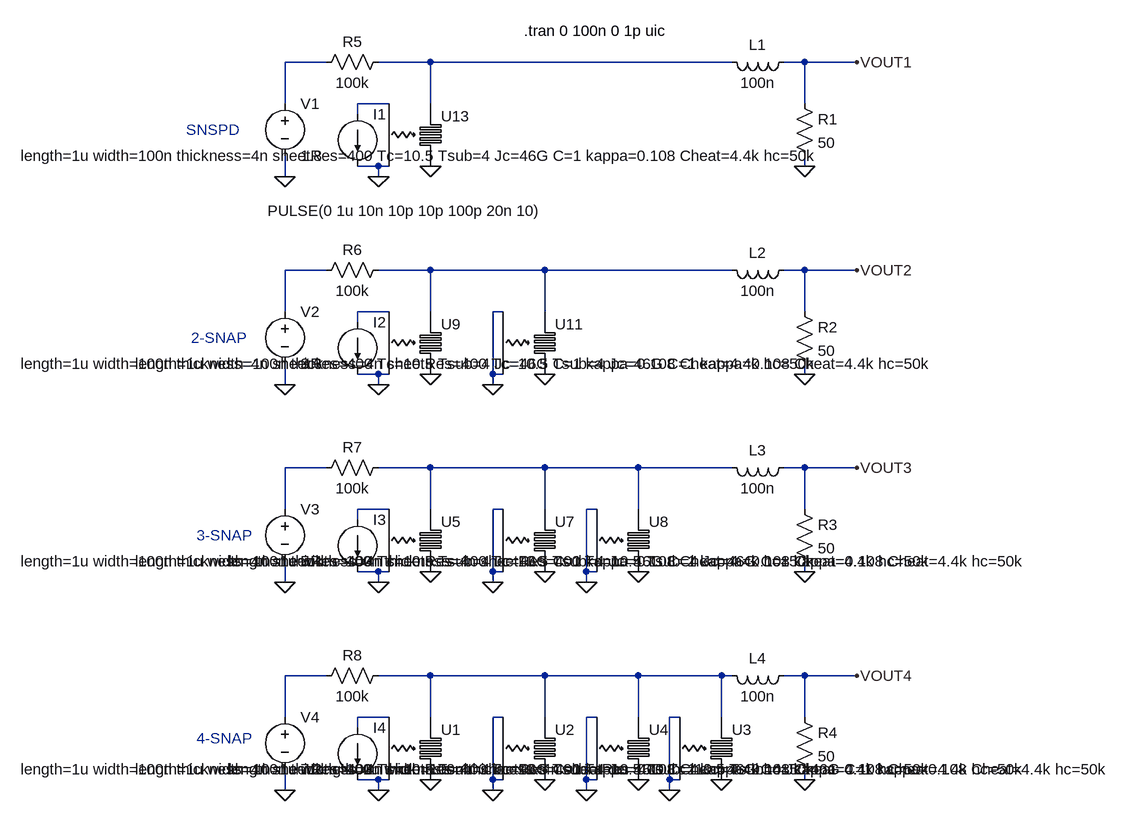
[diagram p0: schematic snspd-multi-snap-50nH-wire-100nH-Choke.asc]
snspd-multi-snap-50nH-wire-100nH-Choke.asc, the LTspice schematic file:
Version 4
SHEET 1 880 680
WIRE -208 -912 -272 -912
WIRE -48 -912 -128 -912
WIRE 416 -912 -48 -912
WIRE 528 -912 496 -912
WIRE 608 -912 528 -912
WIRE -272 -848 -272 -912
WIRE -112 -848 -160 -848
WIRE -48 -848 -48 -912
WIRE 528 -848 528 -912
WIRE -160 -832 -160 -848
WIRE -128 -752 -160 -752
WIRE -112 -752 -128 -752
WIRE 528 -752 528 -768
WIRE -272 -736 -272 -768
WIRE -128 -736 -128 -752
WIRE -208 -592 -272 -592
WIRE -48 -592 -128 -592
WIRE 128 -592 -48 -592
WIRE 416 -592 128 -592
WIRE 528 -592 496 -592
WIRE 608 -592 528 -592
WIRE -272 -528 -272 -592
WIRE -112 -528 -160 -528
WIRE -48 -528 -48 -592
WIRE 64 -528 48 -528
WIRE 128 -528 128 -592
WIRE 528 -528 528 -592
WIRE -160 -512 -160 -528
WIRE -128 -432 -160 -432
WIRE -112 -432 -128 -432
WIRE 48 -432 48 -528
WIRE 64 -432 48 -432
WIRE 528 -432 528 -448
WIRE -272 -416 -272 -448
WIRE -128 -416 -128 -432
WIRE 48 -416 48 -432
WIRE -208 -288 -272 -288
WIRE -48 -288 -128 -288
WIRE 128 -288 -48 -288
WIRE 272 -288 128 -288
WIRE 416 -288 272 -288
WIRE 528 -288 496 -288
WIRE 608 -288 528 -288
WIRE -272 -224 -272 -288
WIRE -112 -224 -160 -224
WIRE -48 -224 -48 -288
WIRE 64 -224 48 -224
WIRE 128 -224 128 -288
WIRE 208 -224 192 -224
WIRE 272 -224 272 -288
WIRE 528 -224 528 -288
WIRE -160 -208 -160 -224
WIRE -128 -128 -160 -128
WIRE -112 -128 -128 -128
WIRE 48 -128 48 -224
WIRE 64 -128 48 -128
WIRE 192 -128 192 -224
WIRE 208 -128 192 -128
WIRE 528 -128 528 -144
WIRE -272 -112 -272 -144
WIRE -128 -112 -128 -128
WIRE 48 -112 48 -128
WIRE 192 -112 192 -128
WIRE -208 32 -272 32
WIRE -48 32 -128 32
WIRE 128 32 -48 32
WIRE 272 32 128 32
WIRE 400 32 272 32
WIRE 416 32 400 32
WIRE 528 32 496 32
WIRE 608 32 528 32
WIRE -272 96 -272 32
WIRE -112 96 -160 96
WIRE -48 96 -48 32
WIRE 64 96 48 96
WIRE 128 96 128 32
WIRE 208 96 192 96
WIRE 272 96 272 32
WIRE 336 96 320 96
WIRE 400 96 400 32
WIRE 528 96 528 32
WIRE -160 112 -160 96
WIRE -128 192 -160 192
WIRE -112 192 -128 192
WIRE 48 192 48 96
WIRE 64 192 48 192
WIRE 192 192 192 96
WIRE 208 192 192 192
WIRE 320 192 320 96
WIRE 336 192 320 192
WIRE 528 192 528 176
WIRE -272 208 -272 176
WIRE -128 208 -128 192
WIRE 48 208 48 192
WIRE 192 208 192 192
WIRE 320 208 320 192
FLAG 528 192 0
FLAG -48 192 0
FLAG -128 208 0
FLAG -272 208 0
FLAG 400 192 0
FLAG 320 208 0
FLAG 128 192 0
FLAG 48 208 0
FLAG 272 192 0
FLAG 192 208 0
FLAG 528 -128 0
FLAG -48 -128 0
FLAG -128 -112 0
FLAG -272 -112 0
FLAG 128 -128 0
FLAG 48 -112 0
FLAG 272 -128 0
FLAG 192 -112 0
FLAG 528 -432 0
FLAG -48 -432 0
FLAG -128 -416 0
FLAG -272 -416 0
FLAG 128 -432 0
FLAG 48 -416 0
FLAG 528 -752 0
FLAG -48 -752 0
FLAG -128 -736 0
FLAG -272 -736 0
FLAG 608 -912 VOUT1
FLAG 608 -592 VOUT2
FLAG 608 -288 VOUT3
FLAG 608 32 VOUT4
SYMBOL snspdWithPhotonPort -48 144 R0
SYMATTR InstName U1
SYMATTR Value Lind=50n
SYMBOL res 512 80 R0
SYMATTR InstName R4
SYMATTR Value 50
SYMBOL current -160 112 R0
WINDOW 3 -244 -151 Invisible 2
WINDOW 123 0 0 Left 2
WINDOW 39 0 0 Left 2
SYMATTR Value PULSE(0 1u 10n 10p 10p 100p 20n 10)
SYMATTR InstName I4
SYMBOL ind 512 16 R90
WINDOW 0 5 56 VBottom 2
WINDOW 3 32 56 VTop 2
SYMATTR InstName L4
SYMATTR Value 100n
SYMBOL voltage -272 80 R0
WINDOW 123 0 0 Left 2
SYMATTR InstName V4
SYMATTR Value 7.2
SYMATTR SpiceLine Rser=0
SYMBOL res -112 16 R90
WINDOW 0 0 56 VBottom 2
WINDOW 3 32 56 VTop 2
SYMATTR InstName R8
SYMATTR Value 100k
SYMBOL snspdWithPhotonPort 400 144 R0
SYMATTR InstName U3
SYMATTR Value Lind=50n
SYMBOL snspdWithPhotonPort 128 144 R0
SYMATTR InstName U2
SYMATTR Value Lind=50n
SYMBOL snspdWithPhotonPort 272 144 R0
SYMATTR InstName U4
SYMATTR Value Lind=50n
SYMBOL snspdWithPhotonPort -48 -176 R0
SYMATTR InstName U5
SYMATTR Value Lind=50n
SYMBOL res 512 -240 R0
SYMATTR InstName R3
SYMATTR Value 50
SYMBOL current -160 -208 R0
WINDOW 3 -244 -151 Invisible 2
WINDOW 123 0 0 Left 2
WINDOW 39 0 0 Left 2
SYMATTR Value PULSE(0 1u 10n 10p 10p 100p 20n 10)
SYMATTR InstName I3
SYMBOL ind 512 -304 R90
WINDOW 0 5 56 VBottom 2
WINDOW 3 32 56 VTop 2
SYMATTR InstName L3
SYMATTR Value 100n
SYMBOL voltage -272 -240 R0
WINDOW 123 0 0 Left 2
SYMATTR InstName V3
SYMATTR Value 5.4
SYMATTR SpiceLine Rser=0
SYMBOL res -112 -304 R90
WINDOW 0 0 56 VBottom 2
WINDOW 3 32 56 VTop 2
SYMATTR InstName R7
SYMATTR Value 100k
SYMBOL snspdWithPhotonPort 128 -176 R0
SYMATTR InstName U7
SYMATTR Value Lind=50n
SYMBOL snspdWithPhotonPort 272 -176 R0
SYMATTR InstName U8
SYMATTR Value Lind=50n
SYMBOL snspdWithPhotonPort -48 -480 R0
SYMATTR InstName U9
SYMATTR Value Lind=50n
SYMBOL res 512 -544 R0
SYMATTR InstName R2
SYMATTR Value 50
SYMBOL current -160 -512 R0
WINDOW 3 -244 -151 Invisible 2
WINDOW 123 0 0 Left 2
WINDOW 39 0 0 Left 2
SYMATTR Value PULSE(0 1u 10n 10p 10p 100p 20n 10)
SYMATTR InstName I2
SYMBOL ind 512 -608 R90
WINDOW 0 5 56 VBottom 2
WINDOW 3 32 56 VTop 2
SYMATTR InstName L2
SYMATTR Value 100n
SYMBOL voltage -272 -544 R0
WINDOW 123 0 0 Left 2
SYMATTR InstName V2
SYMATTR Value 3.6
SYMATTR SpiceLine Rser=0
SYMBOL res -112 -608 R90
WINDOW 0 0 56 VBottom 2
WINDOW 3 32 56 VTop 2
SYMATTR InstName R6
SYMATTR Value 100k
SYMBOL snspdWithPhotonPort 128 -480 R0
SYMATTR InstName U11
SYMATTR Value Lind=50n
SYMBOL snspdWithPhotonPort -48 -800 R0
SYMATTR InstName U13
SYMATTR Value Lind=50n
SYMBOL res 512 -864 R0
SYMATTR InstName R1
SYMATTR Value 50
SYMBOL current -160 -832 R0
WINDOW 3 -139 149 Left 2
WINDOW 123 0 0 Left 2
WINDOW 39 0 0 Left 2
SYMATTR Value PULSE(0 1u 10n 10p 10p 100p 20n 10)
SYMATTR InstName I1
SYMBOL ind 512 -928 R90
WINDOW 0 5 56 VBottom 2
WINDOW 3 32 56 VTop 2
SYMATTR InstName L1
SYMATTR Value 100n
SYMBOL voltage -272 -864 R0
WINDOW 123 0 0 Left 2
SYMATTR InstName V1
SYMATTR Value 1.8
SYMATTR SpiceLine Rser=0
SYMBOL res -112 -928 R90
WINDOW 0 0 56 VBottom 2
WINDOW 3 32 56 VTop 2
SYMATTR InstName R5
SYMATTR Value 100k
TEXT 96 -960 Left 2 !.tran 0 100n 0 1p uic
TEXT -424 -808 Left 2 ;SNSPD
TEXT -416 -488 Left 2 ;2-SNAP
TEXT -408 -184 Left 2 ;3-SNAP
TEXT -408 128 Left 2 ;4-SNAP

The netlist it stands for:
* snspd-multi-snap-50nH-wire-100nH-Choke.asc
XU1 N012 0 N011 0 nanowireDynamic Lind=50n length=1u width=100n thickness=4n sheetRes=400 Tc=10.5 Tsub=4 Jc=46G C=1 kappa=0.108 Cheat=4.4k hc=50k  ; pins gate-in photon-out source drain
R4 VOUT4 0 50
I4 N012 0 PULSE(0 1u 10n 10p 10p 100p 20n 10)
L4 VOUT4 N011 100n
V4 N010 0 7.2 Rser=0
R8 N011 N010 100k
XU3 0 0 N011 0 nanowireDynamic Lind=50n length=1u width=100n thickness=4n sheetRes=400 Tc=10.5 Tsub=4 Jc=46G C=1 kappa=0.108 Cheat=4.4k hc=50k  ; pins gate-in photon-out source drain
XU2 0 0 N011 0 nanowireDynamic Lind=50n length=1u width=100n thickness=4n sheetRes=400 Tc=10.5 Tsub=4 Jc=46G C=1 kappa=0.108 Cheat=4.4k hc=50k  ; pins gate-in photon-out source drain
XU4 0 0 N011 0 nanowireDynamic Lind=50n length=1u width=100n thickness=4n sheetRes=400 Tc=10.5 Tsub=4 Jc=46G C=1 kappa=0.108 Cheat=4.4k hc=50k  ; pins gate-in photon-out source drain
XU5 N009 0 N008 0 nanowireDynamic Lind=50n length=1u width=100n thickness=4n sheetRes=400 Tc=10.5 Tsub=4 Jc=46G C=1 kappa=0.108 Cheat=4.4k hc=50k  ; pins gate-in photon-out source drain
R3 VOUT3 0 50
I3 N009 0 PULSE(0 1u 10n 10p 10p 100p 20n 10)
L3 VOUT3 N008 100n
V3 N007 0 5.4 Rser=0
R7 N008 N007 100k
XU7 0 0 N008 0 nanowireDynamic Lind=50n length=1u width=100n thickness=4n sheetRes=400 Tc=10.5 Tsub=4 Jc=46G C=1 kappa=0.108 Cheat=4.4k hc=50k  ; pins gate-in photon-out source drain
XU8 0 0 N008 0 nanowireDynamic Lind=50n length=1u width=100n thickness=4n sheetRes=400 Tc=10.5 Tsub=4 Jc=46G C=1 kappa=0.108 Cheat=4.4k hc=50k  ; pins gate-in photon-out source drain
XU9 N006 0 N005 0 nanowireDynamic Lind=50n length=1u width=100n thickness=4n sheetRes=400 Tc=10.5 Tsub=4 Jc=46G C=1 kappa=0.108 Cheat=4.4k hc=50k  ; pins gate-in photon-out source drain
R2 VOUT2 0 50
I2 N006 0 PULSE(0 1u 10n 10p 10p 100p 20n 10)
L2 VOUT2 N005 100n
V2 N004 0 3.6 Rser=0
R6 N005 N004 100k
XU11 0 0 N005 0 nanowireDynamic Lind=50n length=1u width=100n thickness=4n sheetRes=400 Tc=10.5 Tsub=4 Jc=46G C=1 kappa=0.108 Cheat=4.4k hc=50k  ; pins gate-in photon-out source drain
XU13 N003 0 N002 0 nanowireDynamic Lind=50n length=1u width=100n thickness=4n sheetRes=400 Tc=10.5 Tsub=4 Jc=46G C=1 kappa=0.108 Cheat=4.4k hc=50k  ; pins gate-in photon-out source drain
R1 VOUT1 0 50
I1 N003 0 PULSE(0 1u 10n 10p 10p 100p 20n 10)
L1 VOUT1 N002 100n
V1 N001 0 1.8 Rser=0
R5 N002 N001 100k
.tran 0 100n 0 1p uic
* SNSPD
* 2-SNAP
* 3-SNAP
* 4-SNAP
.lib snspd.lib
.backanno
.end